# Altium project PCB_Project.PrjPcb
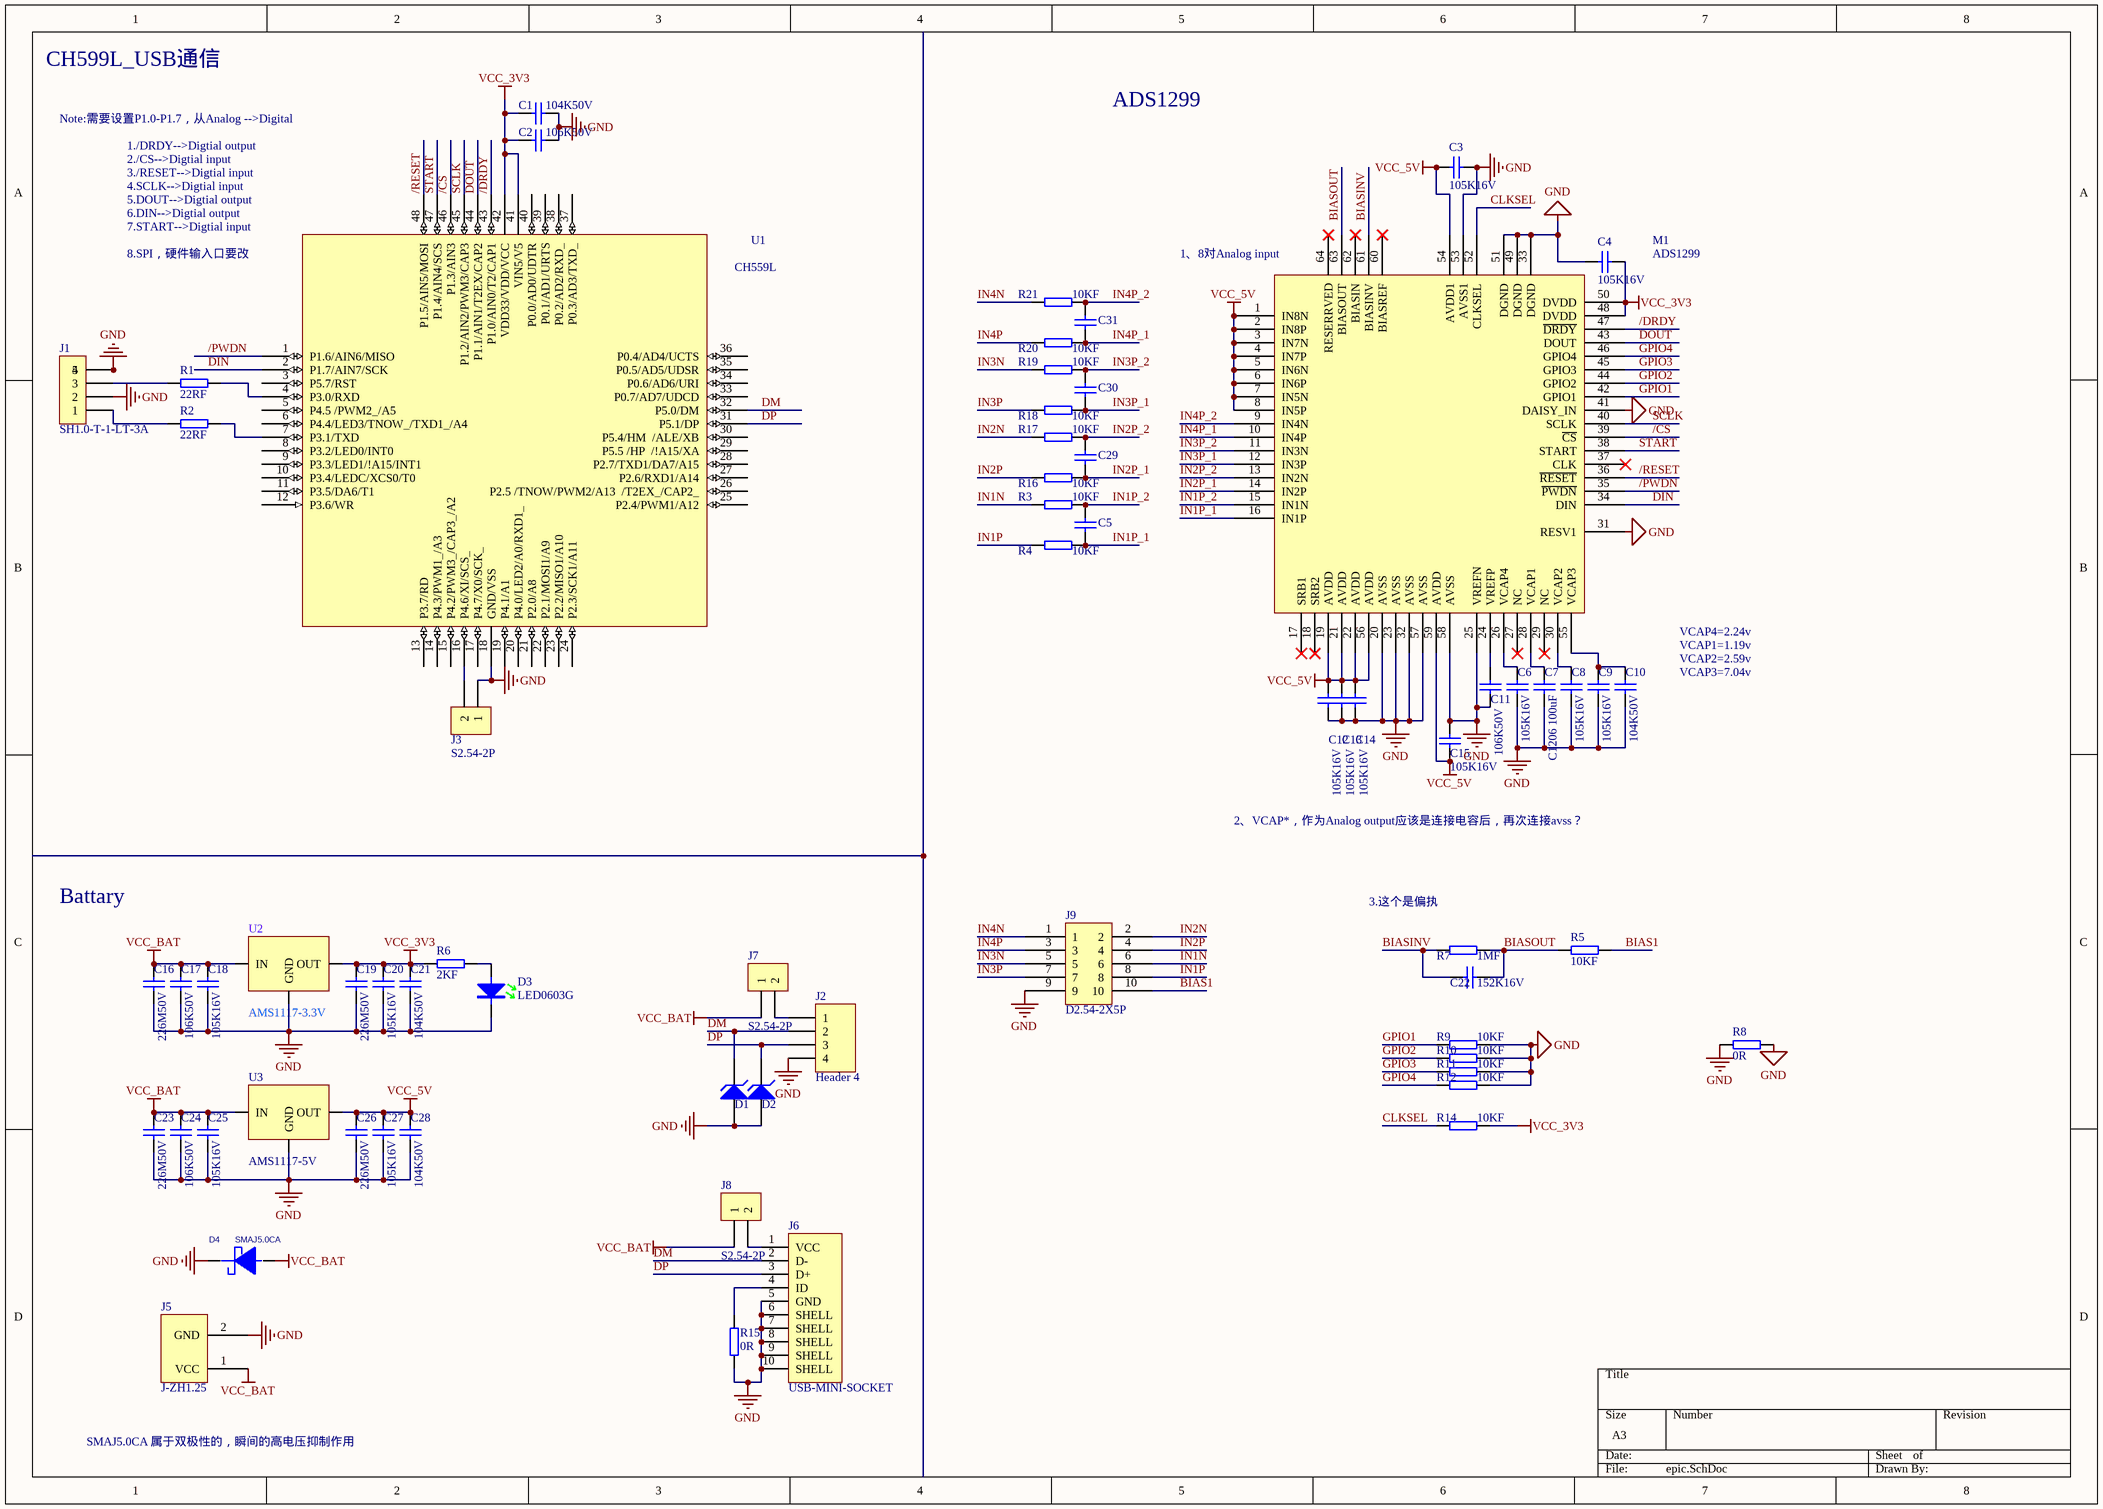
[diagram p0: epic.SchDoc]
1 sheet, 67 parts. Net scope: global (net labels, ports and power ports of the same name join across sheets).
Board files: epic.PcbDoc, epic_panel.PcbDoc

## Sheet epic.SchDoc
size A3

### Parts
C1  104K50V  [C0603]
C2  106K50V  [C0603]
C3  105K16V  [C0603]
C4  105K16V  [C0603]
C5  101K10V  [C0603]  (value not drawn)
C6  105K16V  [C0603]
C7  C1206 100uF  [C1206]
C8  105K16V  [C0603]
C9  105K16V  [C0603]
C10  104K50V  [C0603]
C11  106K50V  [C0603]
C12  105K16V  [C0603]
C13  105K16V  [C0603]
C14  105K16V  [C0603]
C15  105K16V  [C0603]
C16  226M50V  [C0805]
C17  106K50V  [C0603]
C18  105K16V  [C0603]
C19  226M50V  [C0805]
C20  105K16V  [C0603]
C21  104K50V  [C0603]
C22  152K16V  [C0603]
C23  226M50V  [C0805]
C24  106K50V  [C0603]
C25  105K16V  [C0603]
C26  226M50V  [C0805]
C27  105K16V  [C0603]
C28  104K50V  [C0603]
C29  101K10V  [C0603]  (value not drawn)
C30  101K10V  [C0603]  (value not drawn)
C31  101K10V  [C0603]  (value not drawn)
D1  ESDA_TR1/0603  [HS_0603D]  (value not drawn)
D2  ESDA_TR1/0603  [HS_0603D]  (value not drawn)
D3  LED0603G  [D-LED0603G]
D4  SMAJ5.0CA  [DO-214]
J1  SH1.0-T-1-LT-3A  [J-SH1.0-T-1-LT-3A]
J2  Header 4  [USB-AB]
J3  S2.54-2P  [S2.54-2P]
J5  J-ZH1.25  [ZH1.25_2P]
J6  USB-MINI-SOCKET  [MICRO-USB - 5.9]
J7  S2.54-2P  [S2.54-2P]
J8  S2.54-2P  [S2.54-2P]
J9  D2.54-2X5P  [D2.54-2X5P]
M1  ADS1299  [ADS1299-TSQFP50P1200X1200X105-64N]
R1  22RF  [R0603]
R2  22RF  [R0603]
R3  10KF  [R0603]
R4  10KF  [R0603]
R5  10KF  [R0603]
R6  2KF  [R0603]
R7  1MF  [R0603]
R8  0R  [R0603]
R9  10KF  [R0603]
R10  10KF  [R0603]
R11  10KF  [R0603]
R12  10KF  [R0603]
R14  10KF  [R0603]
R15  0R  [R0603]
R16  10KF  [R0603]
R17  10KF  [R0603]
R18  10KF  [R0603]
R19  10KF  [R0603]
R20  10KF  [R0603]
R21  10KF  [R0603]
U1  CH559L  [LQFP48]
U2  AMS1117-3.3V  [SOT-223]
U3  AMS1117-5V  [SOT-223]

### Nets
GND: C1.1 C2.1 C3.1 C4.1 C6.2 C7.1 C8.2 C9.2 C10.1 C11.1 C12.2 C13.2 C14.2 C15.2 C16.2 C17.2 C18.2 C19.2 C20.2 C21.1 C23.2 C24.2 C25.2 C26.2 C27.2 C28.1 D1.1(A) D2.1(A) D3.2 D4.2(-) J1.2 J1.4 J1.5 J2.4 J3.1 J5.2(GND) J6.5(GND) J6.6(SHELL) J6.7(SHELL) J6.8(SHELL) J6.9(SHELL) J6.10(SHELL) J9.9 M1.20(AVSS) M1.23(AVSS) M1.25(VREFN) M1.31(RESV1) M1.32(AVSS) M1.33(DGND) M1.41(DAISY_IN) M1.49(DGND) M1.51(DGND) M1.53(AVSS1) M1.57(AVSS) M1.58(AVSS) R8.1 R8.2 R9.2 R10.2 R11.2 R12.2 R15.1 U1.18(GND/VSS) U2.1(GND) U3.1(GND)
VCC_3V3: C1.2 C2.2 C4.2 C19.1 C20.1 C21.2 M1.48(DVDD) M1.50(DVDD) R6.1 R14.2 U1.41(VIN5/V5) U1.42(VDD33/VDD/VCC) U2.2(OUT)
VCC_5V: C3.2 C12.1 C13.1 C14.1 C15.1 C26.1 C27.1 C28.2 M1.1(IN8N) M1.2(IN8P) M1.3(IN7N) M1.4(IN7P) M1.5(IN6N) M1.6(IN6P) M1.7(IN5N) M1.8(IN5P) M1.19(AVDD) M1.21(AVDD) M1.22(AVDD) M1.54(AVDD1) M1.56(AVDD) M1.59(AVDD) U3.2(OUT)
VCC_BAT: C16.1 C17.1 C18.1 C23.1 C24.1 C25.1 D4.1(+) J5.1(VCC) J7.1 J8.1 U2.3(IN) U3.3(IN)
/CS: M1.39(~{CS}) U1.46(P1.3/AIN3)
/DRDY: M1.47(~{DRDY}) U1.43(P1.0/AIN0/T2/CAP1)
/PWDN: M1.35(~{PWDN}) U1.1(P1.6/AIN6/MISO)
/RESET: M1.36(~{RESET}) U1.48(P1.5/AIN5/MOSI)
BIAS1: J9.10 R5.2
BIASINV: C22.2 M1.61(BIASINV) R7.1
BIASOUT: C22.1 M1.63(BIASOUT) R5.1 R7.2
CLKSEL: M1.52(CLKSEL) R14.1
DIN: M1.34(DIN) U1.2(P1.7/AIN7/SCK)
DM: D1.2(K) J2.2 J6.2(D-) U1.32(P5.0/DM)
DOUT: M1.43(DOUT) U1.44(P1.1/AIN1/T2EX/CAP2)
DP: D2.2(K) J2.3 J6.3(D+) U1.31(P5.1/DP)
GPIO1: M1.42(GPIO1) R9.1
GPIO2: M1.44(GPIO2) R10.1
GPIO3: M1.45(GPIO3) R11.1
GPIO4: M1.46(GPIO4) R12.1
IN1N: J9.6 R3.1
IN1P: J9.8 R4.1
IN1P_1: C5.2 M1.16(IN1P) R4.2
IN1P_2: C5.1 M1.15(IN1N) R3.2
IN2N: J9.2 R17.1
IN2P: J9.4 R16.1
IN2P_1: C29.2 M1.14(IN2P) R16.2
IN2P_2: C29.1 M1.13(IN2N) R17.2
IN3N: J9.5 R19.1
IN3P: J9.7 R18.1
IN3P_1: C30.2 M1.12(IN3P) R18.2
IN3P_2: C30.1 M1.11(IN3N) R19.2
IN4N: J9.1 R21.1
IN4P: J9.3 R20.1
IN4P_1: C31.2 M1.10(IN4P) R20.2
IN4P_2: C31.1 M1.9(IN4N) R21.2
SCLK: M1.40(SCLK) U1.45(P1.2/AIN2/PWM3/CAP3)
START: M1.38(START) U1.47(P1.4/AIN4/SCS)
NetC6_1: C6.1 M1.26(VCAP4)
NetC7_2: C7.2 M1.28(VCAP1)
NetC8_1: C8.1 M1.30(VCAP2)
NetC9_1: C9.1 C10.2 M1.55(VCAP3)
NetC11_2: C11.2 M1.24(VREFP)
NetD3_1: D3.1 R6.2
NetJ1_1: J1.1 R2.1
NetJ1_3: J1.3 R1.1
NetJ2_1: J2.1 J7.2
NetJ3_2: J3.2 U1.16(P4.6/XI/SCS_)
NetJ6_1: J6.1(VCC) J8.2
NetJ6_4: J6.4(ID) R15.2
NetR1_2: R1.2 U1.4(P3.0/RXD)
NetR2_2: R2.2 U1.7(P3.1/TXD)

Not connected (* = marked no-connect by the designer): M1 17(SRB1)* 18(SRB2)* 27(NC)* 29(NC)* 37(CLK)* 60(BIASREF)* 62(BIASIN)* 64(RESERRVED)*; U1 3(P5.7/RST) 5(P4.5_/PWM2_/A5) 6(P4.4/LED3/TNOW_/TXD1_/A4) 8(P3.2/LED0/INT0) 9(P3.3/LED1/!A15/INT1) 10(P3.4/LEDC/XCS0/T0) 11(P3.5/DA6/T1) 12(P3.6/WR) 13(P3.7/RD) 14(P4.3/PWM1_/A3) 15(P4.2/PWM3_/CAP3_/A2) 17(P4.7/X0/SCK_) 19(P4.1/A1) 20(P4.0/LED2/A0/RXD1_) 21(P2.0/A8) 22(P2.1/MOSI1/A9) 23(P2.2/MISO1/A10) 24(P2.3/SCK1/A11) 25(P2.4/PWM1/A12) 26(P2.5_/TNOW/PWM2/A13__/T2EX_/CAP2_) 27(P2.6/RXD1/A14) 28(P2.7/TXD1/DA7/A15) 29(P5.5_/HP__/!A15/XA) 30(P5.4/HM__/ALE/XB) 33(P0.7/AD7/UDCD) 34(P0.6/AD6/URI) 35(P0.5/AD5/UDSR) 36(P0.4/AD4/UCTS) 37(P0.3/AD3/TXD_) 38(P0.2/AD2/RXD_) 39(P0.1/AD1/URTS) 40(P0.0/AD0/UDTR)

### Notes on the sheet
- CH599L_USB通信
- ADS1299
- Note:需要设置P1.0-P1.7，从Analog -->Digital
- 1./DRDY-->Digtial output
- 2./CS-->Digtial input
- 3./RESET-->Digtial input
- 4.SCLK-->Digtial input
- (near U1) 5.DOUT-->Digtial output
- (near U1) 6.DIN-->Digtial output
- (near U1) 7.START-->Digtial input
- 8.SPI，硬件输入口要改
- (near M1) 1、8对Analog input
- VCAP4=2.24v
- VCAP1=1.19v
- VCAP2=2.59v
- VCAP3=7.04v
- 2、VCAP*，作为Analog output应该是连接电容后，再次连接avss？
- Battary
- 3.这个是偏执
- SMAJ5.0CA 属于双极性的，瞬间的高电压抑制作用

### Library data of the parts
C1 C10 C21 C28 = C0603X7R-104K50V: 贴片电容-陶瓷; 规格型号: 100nF±10%_50V_X7R_C0603; 生产商: 风华 三星; 供应商: *; 备注: *
C2 C11 C17 C24 = C0603X7R-106K50V: 贴片电容-陶瓷; 规格型号: 10uF±10%_50V_X7R_C0603; 生产商: 风华 三星; 供应商: *; 备注: *
C3 C4 C6 C8 C9 C12-C15 C18 C20 C25 C27 = C0603X7R-105K16V: 贴片电容-陶瓷; 规格型号: 1uF±10%_16V_X7R_C0603; 生产商: 风华 三星; 供应商: *; 备注: *
C5 C29-C31 = C0603X7R-101K10V: 贴片电容-陶瓷; 规格型号: 100pF±10%_10V_X7R_C0603; 生产商: 风华 三星; 供应商: *; 备注: *
C7 = C1206钽电容 --100UF
C16 C19 C23 C26 = C0805Y5V-226M50V: 贴片电容-陶瓷; 规格型号: 22uF±20%_50V_Y5V_C0805; 生产商: 风华 三星; 供应商: *; 备注: *
C22 = C0603X7R-152K16V: 贴片电容-陶瓷
D1 D2 = D Zener: Zener Diode; Published: *; LatestRevisionDate: *; LatestRevisionNote: *; PackageReference: *; Publisher: *
D3 = DLED-0603-G: 贴片二极管-LED; 规格型号: 0603-GREEN; 货品编码: 无样品无编码; 生产商: *; 供应商: *; 备注: *
J1 = SH1.0-T-1-LT-3A: 接插件-SH1.0-T-1-LT-3A; 规格型号: 1.0m立式贴片插座3P/SH1.0-T-1-LT-3A; 供应商: *; 备注: *
J2 = Header 4: Header, 4-Pin; LatestRevisionDate: 17-Jul-2002; LatestRevisionNote: Re-released for DXP Platform.; Publisher: Altium Limited
J3 J7 J8 = J-S2.54-2P: 单排排针-直针; 货品编码: 372013; 供应商: *; 规格型号: S2.54-2P; 备注: *
J6 = J-USB-MINI-SOCKET: USB-A卧式插座; 供应商: *; 备注: *
J9 = J-D2.54-2X5P: 双排排针-直针
M1 = ADS1299: ADS1299-S-PQFP-64; ADS1299: S-PQFP-64
R1 R2 = R0603-22RF: 贴片电阻-通用; 生产商: 厚声 国巨; 规格型号: 22R±5%_1/10W_±200ppm_R0603; 货品编码: 无样品无编码; 备注: *; 供应商: *
R3-R5 R9-R12 R14 R16-R21 = R0603-10KF: 贴片电阻-通用; 生产商: 厚声 国巨; 规格型号: 10K±1%_1/10W_±200ppm_R0603; 备注: *; 供应商: *
R6 = R0603-2KF: 贴片电阻-通用; 生产商: 厚声 国巨; 规格型号: 2K±1%_1/10W_±200ppm_R0603; 备注: *; 供应商: *
R7 = R0603-1MF: 贴片电阻-通用; value: 1MF 0603贴片电阻-通用; 厂商: 10K±1%_1/10W_±200ppm_R0603 国巨
R8 R15 = R0603-0R: 贴片电阻-通用; 生产商: 厚声 国巨; 规格型号: 0R_1/10W_±200ppm_R0603; 货品编码: 无样品无编码; 备注: *; 供应商: *
U1 = CH559L: 单片机
U2 = AP1117-33 SOT-223: 芯片 电源类; 单价: 0.15
U3 = AMS1117-5V: 线性稳压器
D4 = SMAJ5.0CA: PCB DECAL: DO-214; Value: SMAJ5.0CA